# Altium project PCB_Project_TP3_mleroi.PrjPcb
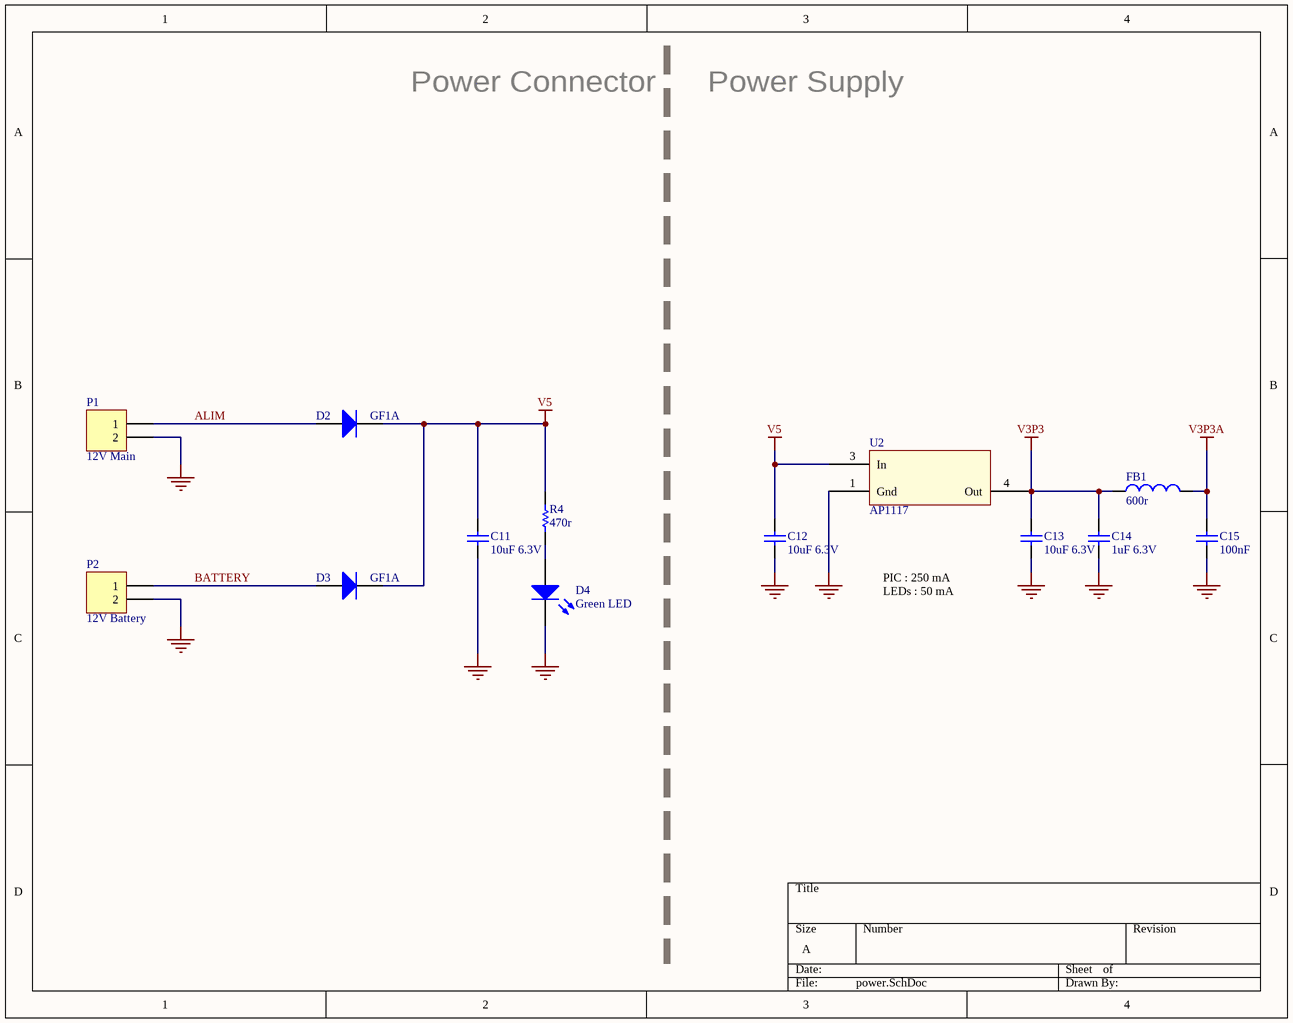
[diagram p0: power.SchDoc]
2 sheets, 15 parts. Net scope: flat (ports and power ports of the same name join across sheets).
Board files: PCB1.PcbDoc, TP3_PCB.PcbDoc
Sheets:
  power.SchDoc
  led.SchDoc

## Sheet power.SchDoc
size A

### Parts
C11  10uF 6.3V  [CAPC2012N]
C12  10uF 6.3V  [CAPC2012N]
C13  10uF 6.3V  [CAPC2012N]
C14  1uF 6.3V  [CAPC1608N]
C15  100nF  [CAPC1608N]
D2  GF1A  [SMA/DO-214AC_21]
D3  GF1A  [SMA/DO-214AC_21]
D4  Green LED  [LED 0805]
FB1  600r  [INDC1608AN]
P1  12V Main  [PHOENIX_1985195]
P2  12V Battery  [PHOENIX_1985195]
R4  470r  [RESC1608N]
U2  AP1117  [TD03B_N]

### Nets
GND: C11.1 C12.2 C13.2 C14.1 C15.1 D4.2(K) P1.2 P2.2 U2.1(Gnd)
V3P3: C13.1 C14.2 FB1.1 U2.4(Out)
V3P3A: C15.2 FB1.2
V5: C11.2 C12.1 D2.2(K) D3.2(K) R4.2 U2.3(In)
ALIM: D2.1(A) P1.1
BATTERY: D3.1(A) P2.1
NetD4_1: D4.1(A) R4.1

### Notes on the sheet
- Power Connector
- Power Supply
- PIC : 250 mA
- LEDs : 50 mA

### Library data of the parts
C11-C15 = Cap: Capacitor; Value: 100pF; Fabricant: Farnell; Published: 8-Jun-2000; LatestRevisionDate: 17-Jul-2002; LatestRevisionNote: Re-released for DXP Platform.; PackageReference: RAD-0.3; Publisher: Altium Limited; PackageDescription: Radial Cap, Thru-Hole; 2 Leads; 0.3 in Pin Spacing
D2 D3 = Diode: Default Diode; Fabricant: Farnell; Published: 8-Jun-2000; LatestRevisionDate: 17-Jul-2002; LatestRevisionNote: Re-released for DXP Platform.; PackageVersion: Sep-1996; PackageReference: SMC; Publisher: Altium Limited; PackageDescription: DO-214-AB/SMC; 2 C-Bend Leads; Body 7.9 x 5.9 mm, inc. leads (LxW); Code_JEDEC: DO-214-AB
D4 = LED0: Typical INFRARED GaAs LED; Fabricant: Farnell; Published: 8-Jun-2000; LatestRevisionDate: 08-Jul-2005; LatestRevisionNote: Mech Layer 1 removed.; PackageReference: LED-0; Publisher: Altium Limited; PackageDescription: LED; 2 Leads
FB1 = Inductor: Code_IEC: 1005; Value: 10mH; Fabricant: Farnell; Published: 8-Jun-2000; LatestRevisionDate: 29-May-2009; LatestRevisionNote: IPC-7351 Footprint Added.; PackageReference: 0402-A; Publisher: Altium Limited; PackageDescription: Chip Inductor; Code_JEITA: 0402
P1 P2 = Header 2: Header, 2-Pin; Fabricant: Farnell; LatestRevisionDate: 17-Jul-2002; LatestRevisionNote: Re-released for DXP Platform.; Publisher: Altium Limited
R4 = Res1: Resistor; Value: 1K; Fabricant: Farnell; Published: 8-Jun-2000; LatestRevisionDate: 17-Jul-2002; LatestRevisionNote: Re-released for DXP Platform.; PackageReference: AXIAL-0.3; Publisher: Altium Limited; PackageDescription: Axial Device, Thru-Hole; 2 Leads; 0.3 in Pin Spacing
U2 = AP1117: 1A LDO, 18V input, DPAK; Fabricant: Farnell; RefFournisseur: 1825285

## Sheet led.SchDoc
size A
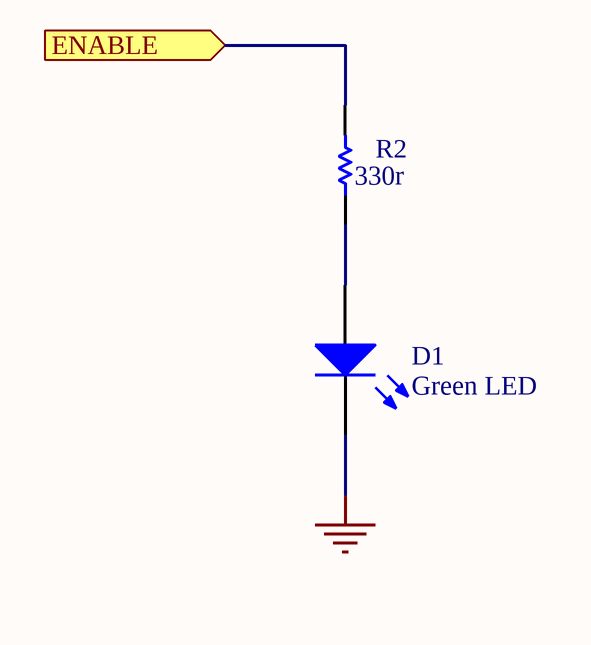
[diagram p1: led.SchDoc]

### Parts
D1  Green LED  [LED 0805]
R2  330r  [RESC1608N]

### Ports
ENABLE

### Nets
GND: D1.2(K)
NetD1_1: D1.1(A) R2.1
NetR2_2: R2.2 ; port ENABLE

### Library data of the parts
D1 = LED0: as D4 on sheet power; Published: 8-Jun-2000; LatestRevisionDate: 08-Jul-2005; LatestRevisionNote: Mech Layer 1 removed.; PackageReference: LED-0; Publisher: Altium Limited; PackageDescription: LED; 2 Leads
R2 = Res1: Resistor; Value: 1K; Fabricant: Farnell; Published: 8-Jun-2000; LatestRevisionDate: 17-Jul-2002; LatestRevisionNote: Re-released for DXP Platform.; PackageReference: AXIAL-0.3; Publisher: Altium Limited; PackageDescription: Axial Device, Thru-Hole; 2 Leads; 0.3 in Pin Spacing

## Nets that join several sheets
GND: power (9 pins), led (D1.2)